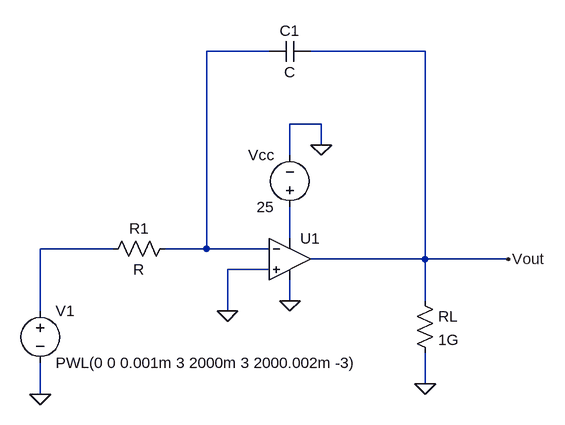
[diagram p0: schematic Draft1.asc]
Draft1.asc, the LTspice schematic file:
Version 4
SHEET 1 880 680
WIRE 208 -176 112 -176
WIRE 448 -176 272 -176
WIRE 288 -64 240 -64
WIRE 288 -32 288 -64
WIRE 240 -16 240 -64
WIRE 240 112 240 64
WIRE -32 128 -144 128
WIRE 112 128 112 -176
WIRE 112 128 48 128
WIRE 208 128 112 128
WIRE 448 144 448 -176
WIRE 448 144 272 144
WIRE 576 144 448 144
WIRE 208 160 144 160
WIRE 240 208 240 176
WIRE 448 208 448 144
WIRE -144 224 -144 128
WIRE 144 224 144 160
WIRE 448 336 448 288
WIRE -144 352 -144 304
FLAG 288 -32 0
FLAG -144 352 0
FLAG 240 208 0
FLAG 448 336 0
FLAG 576 144 Vout
FLAG 144 224 0
SYMBOL OpAmps\\UniversalOpamp2 240 144 R0
SYMATTR InstName U1
SYMBOL voltage 240 80 R180
WINDOW 0 24 96 Left 2
WINDOW 3 24 16 Left 2
WINDOW 123 0 0 Left 0
WINDOW 39 0 0 Left 0
SYMATTR InstName Vcc
SYMATTR Value 25
SYMBOL voltage -144 208 R0
WINDOW 123 0 0 Left 0
WINDOW 39 0 0 Left 0
SYMATTR InstName V1
SYMATTR Value PWL(0 0 0.001m 3 2000m 3 2000.002m -3)
SYMBOL res 64 112 R90
WINDOW 0 0 56 VBottom 2
WINDOW 3 32 56 VTop 2
SYMATTR InstName R1
SYMBOL cap 272 -192 R90
WINDOW 0 0 32 VBottom 2
WINDOW 3 32 32 VTop 2
SYMATTR InstName C1
SYMBOL res 432 192 R0
SYMATTR InstName RL
SYMATTR Value 1G

The netlist it stands for:
* Draft1.asc
XU1 0 N001 N002 0 Vout level.2 Avol=1Meg GBW=10Meg Slew=10Meg ilimit=25m rail=0 Vos=0 phimargin=45 en=0 enk=0 in=0 ink=0 Rin=500Meg  ; pins IN+ IN- V+ V- OUT
Vcc N002 0 25
V1 N003 0 PWL(0 0 0.001m 3 2000m 3 2000.002m -3)
R1 N001 N003 R
C1 Vout N001 C
RL Vout 0 1G
.lib UniversalOpamps2.sub
.backanno
.end